# EasyEDA Pro project Board1.epro

# Schematic Schematic1
Board Name: Board1; Create Date: 2025-12-23; Page Name: P1; Project Name: test-dumbev2; Schematic Name: Schematic1; Update Date: 2026-01-03; Company: EasyEDA.com; Page Size: A4; Version: V1.0
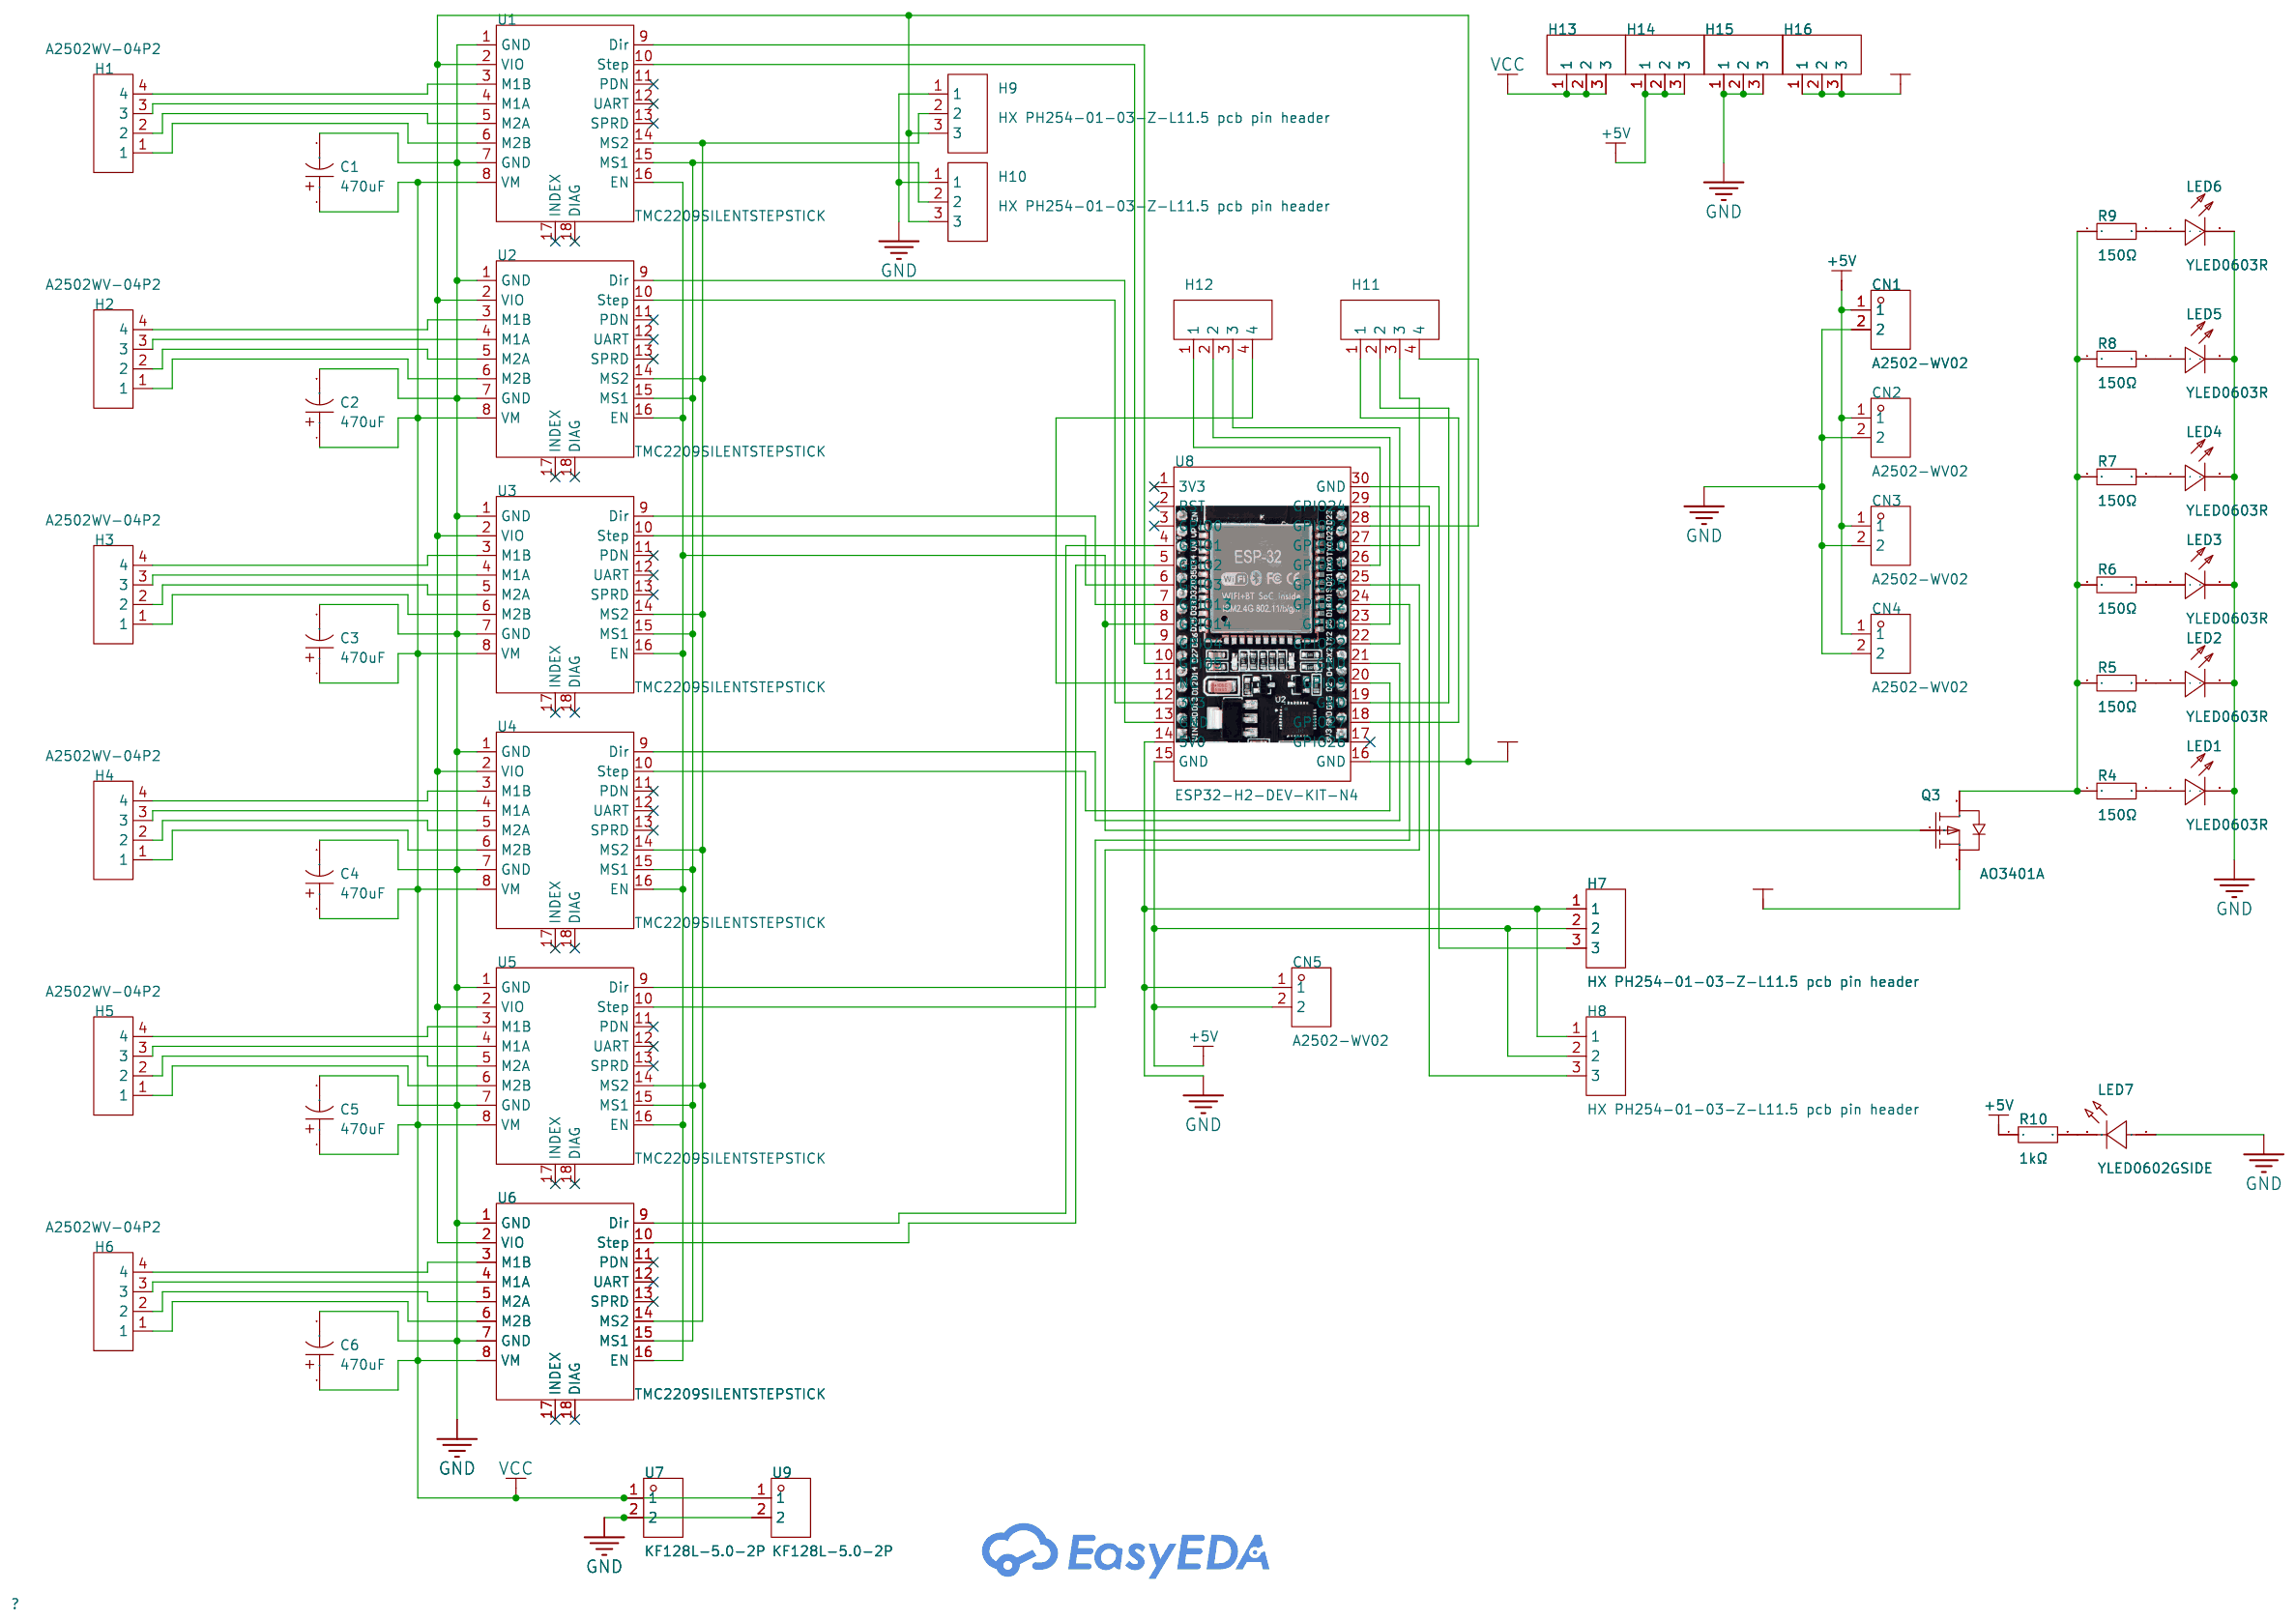
[diagram p0: schematic sheet]

## Parts
C1  470uF  [CAP-TH_BD10.0-P5.00-D0.6-FD]
C2  470uF  [CAP-TH_BD10.0-P5.00-D0.6-FD]
C3  470uF  [CAP-TH_BD10.0-P5.00-D0.6-FD]
C4  470uF  [CAP-TH_BD10.0-P5.00-D0.6-FD]
C5  470uF  [CAP-TH_BD10.0-P5.00-D0.6-FD]
C6  470uF  [CAP-TH_BD10.0-P5.00-D0.6-FD]
CN1  A2502-WV02  [CONN-TH_A2502-WV02]
CN2  A2502-WV02  [CONN-TH_A2502-WV02]
CN3  A2502-WV02  [CONN-TH_A2502-WV02]
CN4  A2502-WV02  [CONN-TH_A2502-WV02]
CN5  A2502-WV02  [CONN-TH_A2502-WV02]
H1  A2502WV-04P2  [CONN-TH_4P-P2.50_A2502WV-04P2]
H2  A2502WV-04P2  [CONN-TH_4P-P2.50_A2502WV-04P2]
H3  A2502WV-04P2  [CONN-TH_4P-P2.50_A2502WV-04P2]
H4  A2502WV-04P2  [CONN-TH_4P-P2.50_A2502WV-04P2]
H5  A2502WV-04P2  [CONN-TH_4P-P2.50_A2502WV-04P2]
H6  A2502WV-04P2  [CONN-TH_4P-P2.50_A2502WV-04P2]
H7  HX PH254-01-03-Z-L11.5 pcb pin header  [HDR-TH_3P-P2.54-V-M-1]
H8  HX PH254-01-03-Z-L11.5 pcb pin header  [HDR-TH_3P-P2.54-V-M-1]
H9  HX PH254-01-03-Z-L11.5 pcb pin header  [HDR-TH_3P-P2.54-V-M-1]
H10  HX PH254-01-03-Z-L11.5 pcb pin header  [HDR-TH_3P-P2.54-V-M-1]
H11  HX PH254-01-04-Z-L11.5 straight pin header  [HDR-TH_4P-HX-PH254-01-04-Z-L11.5]
H12  HX PH254-01-04-Z-L11.5 straight pin header  [HDR-TH_4P-HX-PH254-01-04-Z-L11.5]
H13  HX PH254-01-03-Z-L11.5 pcb pin header  [HDR-TH_3P-P2.54-V-M-1]
H14  HX PH254-01-03-Z-L11.5 pcb pin header  [HDR-TH_3P-P2.54-V-M-1]
H15  HX PH254-01-03-Z-L11.5 pcb pin header  [HDR-TH_3P-P2.54-V-M-1]
H16  HX PH254-01-03-Z-L11.5 pcb pin header  [HDR-TH_3P-P2.54-V-M-1]
LED1  YLED0603R  [LED0603-FD]
LED2  YLED0603R  [LED0603-FD]
LED3  YLED0603R  [LED0603-FD]
LED4  YLED0603R  [LED0603-FD]
LED5  YLED0603R  [LED0603-FD]
LED6  YLED0603R  [LED0603-FD]
LED7  YLED0602GSIDE  [LED-SMD_L1.6-W1.1-R-RD_GREEN]
Q3  AO3401A  [SOT-23-3_L2.9-W1.3-P1.90-LS2.4-BR]
R4  150Ω  [R0603]
R5  150Ω  [R0603]
R6  150Ω  [R0603]
R7  150Ω  [R0603]
R8  150Ω  [R0603]
R9  150Ω  [R0603]
R10  1kΩ  [R0603]
U1  TMC2209SILENTSTEPSTICK  [COMM-TH_TMC2209SILENTSTEPSTICK]
U2  TMC2209SILENTSTEPSTICK  [COMM-TH_TMC2209SILENTSTEPSTICK]
U3  TMC2209SILENTSTEPSTICK  [COMM-TH_TMC2209SILENTSTEPSTICK]
U4  TMC2209SILENTSTEPSTICK  [COMM-TH_TMC2209SILENTSTEPSTICK]
U5  TMC2209SILENTSTEPSTICK  [COMM-TH_TMC2209SILENTSTEPSTICK]
U6  TMC2209SILENTSTEPSTICK  [COMM-TH_TMC2209SILENTSTEPSTICK]
U7  KF128L-5.0-2P  [CONN-TH_P5.00_KF128L-5.0-2P]
U8  ESP32-H2-DEV-KIT-N4  [COMM-TH_L51.6-W25.4-P2.54-LS22.86]
U9  KF128L-5.0-2P  [CONN-TH_P5.00_KF128L-5.0-2P]

## Library data of the parts
C1-C6 = 50V470uF CD288: Capacitance:470uF Tolerance:±20% Tolerance:±20% Voltage Rating:50V Pin Spacing:5mm Diameter:10mm Height - Seated (Max):20mm Operating Temperature:-40℃~+105℃ Operating Temperature:-40℃~+105℃; LCSC Part Name: 470uF ±20% 50V; Supplier Part: C2960279; Manufacturer: HRK(鸿瑞凯电子); Supplier Footprint: 插件,D10xL20mm; JLCPCB Part Class: Extended Part; Supplier: LCSC; Tolerance: ±20%; Voltage Rating: 50V; Pin Spacing: 5mm; Diameter: 10mm; Height - Seated (Max): 20mm; Operating Temperature: -40℃~+105℃
CN1-CN5 = A2502-WV02: Supplier Part: C9900002556; Supplier Footprint: XHB2.542PIN端子母座; JLCPCB Part Class: Extended Part; Supplier: LCSC
H1-H6 = A2502WV-04P2: Pins Structure:1x4P Pitch:2.5mm Mounting Type:Through Hole Reference Series:- Number of Pins:4P Number of Rows:1 Number of PINs Per Row:4 Row Spacing:- Current Rating:3A Operating Temperature:-25℃~+85℃ Operating Temperature:-25℃~+85℃; LCSC Part Name: 白色 1x4P 间距:2.5mm 直插; Supplier Part: C476965; Manufacturer: HR(灿达); Supplier Footprint: 插件,P=2.5mm; JLCPCB Part Class: Extended Part; Datasheet: https://item.szlcsc.com/datasheet/A2502WV-04P2/483965.html; Supplier: LCSC; Pins Structure: 1x4P; Pitch: 2.5mm; Mounting Type: Through Hole; Number of Pins: 4P; Number of Rows: 1; Number of PINs Per Row: 4; Current Rating: 3A; Operating Temperature: -25℃~+85℃
H7-H10 H13-H16 = HX PH254-01-03-Z-L11.5 pcb pin header: Pin Structure:1x3P Pitch:2.54mm Circluar Pins/Square Pins:Pin Header Mounting Type:Through Hole Number of Rows:1 Number of Pins:3P Current Rating:3A Voltage Rating (Max):1kV Length of Mating Pin:6mm Insulation Height:2.5mm Length of End Connection Pin:3mm; LCSC Part Name: 1x3P 间距:2.54mm 方针 直插; Supplier Part: C52016391; Manufacturer: hanxia(韩下); Supplier Footprint: 插件,P=2.54mm; JLCPCB Part Class: Extended Part; Datasheet: https://item.szlcsc.com/datasheet/HX%2520PH254-01-03-Z-L11.5%2520pcb%2520pin%2520header/54760436.html; Supplier: LCSC; Pin Structure: 1x3P; Pitch: 2.54mm; Circluar Pins/Square Pins: Pin Header; Mounting Type: Through Hole; Number of Rows: 1; Number of Pins: 3P; Current Rating: 3A; Voltage Rating (Max): 1kV; Length of Mating Pin: 6mm; Insulation Height: 2.5mm; Length of End Connection Pin: 3mm; Contact Material: Brass; Contact Plating: Gold; Operating Temperature: -40℃~+105℃
H11 H12 = HX PH254-01-04-Z-L11.5 straight pin header: Pin Structure:1x4P Pitch:2.54mm Circluar Pins/Square Pins:Pin Header Mounting Type:Through Hole Number of Rows:1 Number of Pins:4P Current Rating:3A Voltage Rating (Max):1kV Length of Mating Pin:6mm Insulation Height:2.5mm Length of End Connection Pin:3mm; LCSC Part Name: 1x4P 间距:2.54mm 方针 直插; Supplier Part: C52016392; Manufacturer: hanxia(韩下); Supplier Footprint: 插件,P=2.54mm; JLCPCB Part Class: Extended Part; Datasheet: https://item.szlcsc.com/datasheet/HX%2520PH254-01-04-Z-L11.5%2520straight%2520pin%2520header/54760437.html; Supplier: LCSC; Pin Structure: 1x4P; Pitch: 2.54mm; Circluar Pins/Square Pins: Pin Header; Mounting Type: Through Hole; Number of Rows: 1; Number of Pins: 4P; Current Rating: 3A; Voltage Rating (Max): 1kV; Length of Mating Pin: 6mm; Insulation Height: 2.5mm; Length of End Connection Pin: 3mm; Contact Material: Brass; Contact Plating: Gold; Operating Temperature: -40℃~+105℃
LED1-LED6 = YLED0603R: Lamp Holder Type:-；- Illumination Color:Red Voltage - Forward(Vf):1.8V~2.4V Voltage - Forward(Vf):1.8V~2.4V Power(Watts):- Forward Current:25mA Wavelength - Dominant:620nm~625nm Wavelength - Dominant:620nm~625nm Peak Wavelength:- Diode Configuration:Discr; LCSC Part Name: 红色 独立二极管; Supplier Part: C19171390; Manufacturer: YONGYUTAI(永裕泰); Supplier Footprint: 0603; JLCPCB Part Class: Extended Part; Datasheet: https://item.szlcsc.com/datasheet/YLED0603R/20382441.html; Supplier: LCSC; Lamp Holder Type: -；-; Illumination Color: Red; Voltage - Forward(Vf): 1.8V~2.4V; Forward Current: 25mA; Wavelength - Dominant: 620nm~625nm; Diode Configuration: Discrete Diode; Luminous Intensity: 120mcd; Viewing Angle: 120°; Operating Temperature: -40℃~+85℃
LED7 = YLED0602GSIDE: Illumination Color:Emerald Green Voltage - Forward(Vf):2.5V~3.1V Voltage - Forward(Vf):2.5V~3.1V Power(Watts):100mW Forward Current:20mA Wavelength - Dominant:534nm Wavelength - Dominant:534nm Peak Wavelength:525nm Diode Configuration:- Lens Color:Water C; Supplier Part: C41419561; Manufacturer: YONGYUTAI(永裕泰); Supplier Footprint: 0603; JLCPCB Part Class: Extended Part; Datasheet: https://item.szlcsc.com/datasheet/YLED0602GSIDE/43252029.html; Supplier: LCSC; Illumination Color: Emerald Green; Voltage - Forward(Vf): 2.5V~3.1V; Power(Watts): 100mW; Forward Current: 20mA; Wavelength - Dominant: 534nm; Peak Wavelength: 525nm; Lens Color: Water Clear; Luminous Intensity: 430mcd; Viewing Angle: 120°; Operating Temperature: -40℃~+85℃
Q3 = AO3401A_C5380686: Number:1 P-Channel Drain to Source Voltage:30V Current - Continuous Drain(Id):4.2A RDS(on):90mΩ@2.5V,1A Pd - Power Dissipation:350mW Gate Threshold Voltage (Vgs(th)):1.4V Gate Charge(Qg):7.2nC Input Capacitance(Ciss):880pF Reverse Transfer Capacitance (Cr; LCSC Part Name: P沟道,电流:-4.2A,耐压:-30V; Supplier Part: C5380686; Manufacturer: FUXINSEMI(富芯森美); Supplier Footprint: SOT-23; JLCPCB Part Class: Extended Part; Datasheet: https://item.szlcsc.com/datasheet/AO3401A/6248450.html; Supplier: LCSC; Number: 1 P-Channel; Drain to Source Voltage: 30V; Current - Continuous Drain(Id): 4.2A; RDS(on): 90mΩ@2.5V,1A; Pd - Power Dissipation: 350mW; Gate Threshold Voltage (Vgs(th)): 1.4V; Gate Charge(Qg): 7.2nC; Input Capacitance(Ciss): 880pF; Reverse Transfer Capacitance (Crss@Vds): 65pF; Operating Temperature: -55℃~+150℃
R4-R9 = RMC06031505%N: Type:Thick Film Resistor Resistance:150Ω Tolerance:±5% Tolerance:±5% Power(Watts):100mW Voltage-Supply(Max):50V Temperature Coefficient:±100ppm/℃ Temperature Coefficient:±100ppm/℃ Operating Temperature:-55℃~+155℃ Operating Temperature:-55℃~+155℃; LCSC Part Name: 150Ω ±5% 100mW; Supplier Part: C325755; Manufacturer: Tyohm(幸亚电阻); Supplier Footprint: 0603; JLCPCB Part Class: Extended Part; Datasheet: https://item.szlcsc.com/datasheet/RMC06031505%2525N/305960.html; Supplier: LCSC; Type: Thick Film Resistor; Tolerance: ±5%; Power(Watts): 100mW; Voltage-Supply(Max): 50V; Temperature Coefficient: ±100ppm/℃; Operating Temperature: -55℃~+155℃
R10 = 0603WAF1001T5E: Type:Thick Film Resistor Resistance:1kΩ Tolerance:±1% Tolerance:±1% Power(Watts):100mW Voltage-Supply(Max):75V Temperature Coefficient:±100ppm/℃ Temperature Coefficient:±100ppm/℃ Operating Temperature:-55℃~+155℃ Operating Temperature:-55℃~+155℃; LCSC Part Name: 1kΩ ±1% 100mW 厚膜电阻; Supplier Part: C21190; Manufacturer: UNI-ROYAL(厚声); Supplier Footprint: 0603; JLCPCB Part Class: Basic Part; Datasheet: https://item.szlcsc.com/datasheet/0603WAF1001T5E/21904.html; Supplier: LCSC; Type: Thick Film Resistor; Tolerance: ±1%; Power(Watts): 100mW; Voltage-Supply(Max): 75V; Temperature Coefficient: ±100ppm/℃; Operating Temperature: -55℃~+155℃
U1-U6 = TMC2209SILENTSTEPSTICK: Type:Power Management; Supplier Part: C17375345; Manufacturer: TRINAMIC; JLCPCB Part Class: Extended Part; Datasheet: https://item.szlcsc.com/datasheet/TMC2209SILENTSTEPSTICK/18504516.html; Supplier: LCSC; Type: Power Management
U7 U9 = KF128L-5.0-2P: LCSC Part Name: 间距P=5.0mm 2Pin位 直插 直针 可拼接 铜 环保; Supplier Part: C474938; Manufacturer: KEFA(科发); Supplier Footprint: 插件,P=5mm; JLCPCB Part Class: Extended Part; Datasheet: https://item.szlcsc.com/datasheet/KF128L-5.0-2P/481556.html; Supplier: LCSC
U8 = ESP32-H2-DEV-KIT-N4: Supplier Part: C9900173960; Supplier Footprint: 插件; Supplier: LCSC

## Nets
+3V3: H9.3 H10.3 H16.1 H16.2 H16.3 Q3.2(S) U1.2(VIO) U2.2(VIO) U3.2(VIO) U4.2(VIO) U5.2(VIO) U6.2(VIO) U8.16(GND)
+5V: CN1.1 CN2.1 CN3.1 CN4.1 CN5.2 H7.2 H8.2 H14.1 H14.2 H14.3 R10.1 U8.15(GND)
GND: C1.2 C2.2 C3.2 C4.2 C5.2 C6.2 CN1.2 CN2.2 CN3.2 CN4.2 CN5.1 H7.1 H8.1 H9.1 H10.1 H15.1 H15.2 H15.3 LED1.2(-) LED2.2(-) LED3.2(-) LED4.2(-) LED5.2(-) LED6.2(-) LED7.1(A) U1.1(GND) U1.7(GND) U2.1(GND) U2.7(GND) U3.1(GND) U3.7(GND) U4.1(GND) U4.7(GND) U5.1(GND) U5.7(GND) U6.1(GND) U6.7(GND) U7.2 U8.14(5V0) U9.2
VCC: C1.1 C2.1 C3.1 C4.1 C5.1 C6.1 H13.1 H13.2 H13.3 U1.8(VM) U2.8(VM) U3.8(VM) U4.8(VM) U5.8(VM) U6.8(VM) U7.1 U9.1
$1N6110: H2.1 U2.6(M2B)
$1N6116: H2.2 U2.5(M2A)
$1N6130: H2.3 U2.4(M1A)
$1N6134: H2.4 U2.3(M1B)
$1N6138: H1.4 U1.3(M1B)
$1N6142: H1.3 U1.4(M1A)
$1N6144: H1.2 U1.5(M2A)
$1N6148: H1.1 U1.6(M2B)
$1N6152: H3.4 U3.3(M1B)
$1N6156: H3.3 U3.4(M1A)
$1N6158: H3.2 U3.5(M2A)
$1N6162: H3.1 U3.6(M2B)
$1N6166: H4.4 U4.3(M1B)
$1N6170: H4.3 U4.4(M1A)
$1N6172: H4.2 U4.5(M2A)
$1N6176: H4.1 U4.6(M2B)
$1N6180: H5.4 U5.3(M1B)
$1N6184: H5.3 U5.4(M1A)
$1N6186: H5.2 U5.5(M2A)
$1N6190: H5.1 U5.6(M2B)
$1N6194: H6.4 U6.3(M1B)
$1N6198: H6.3 U6.4(M1A)
$1N6200: H6.2 U6.5(M2A)
$1N6204: H6.1 U6.6(M2B)
$1N6621: U1.10(Step) U8.9(GPIO4)
$1N6634: U2.10(Step) U8.12(3V3)
$1N6640: U2.9(Dir) U8.13(GND)
$1N6650: U3.10(Step) U8.6(GPIO3)
$1N6666: U3.9(Dir) U8.7(GPIO13)
$1N6678: U4.10(Step) U8.20(GPIO9)
$1N6689: U4.9(Dir) U8.21(GND)
$1N6700: U5.10(Step) U8.24(GPIO12)
$1N6708: U5.9(Dir) U8.25(GPIO25)
$1N8390: H7.3 U8.30(GND)
$1N8397: H8.3 U8.29(GPIO24)
$1N8979: H10.2 U1.15(MS1) U2.15(MS1) U3.15(MS1) U4.15(MS1) U5.15(MS1) U6.15(MS1)
$1N9329: H9.2 U1.14(MS2) U2.14(MS2) U3.14(MS2) U4.14(MS2) U5.14(MS2) U6.14(MS2)
$1N9443: U1.9(Dir) U8.10(GPIO5)
$1N9499: U6.10(Step) U8.5(GPIO2)
$1N9508: U6.9(Dir) U8.4(GPIO1)
$1N13058: H12.1 U8.26(GPIO11)
$1N13065: H12.2 U8.23(GPIO8)
$1N13086: H12.3 U8.22(GPIO22)
$1N13111: H11.2 U8.19(GND)
$1N13121: H11.1 U8.18(GPIO27)
$1N14592: LED1.1(+) R4.2
$1N15391: LED2.1(+) R5.2
$1N15491: LED3.1(+) R6.2
$1N15591: LED4.1(+) R7.2
$1N17393: LED5.1(+) R8.2
$1N17491: LED6.1(+) R9.2
$1N19393: LED7.2(K) R10.2
$1N19496: Q3.3(D) R4.1 R5.1 R6.1 R7.1 R8.1 R9.1
$1N19657: Q3.1(G) U1.16(EN) U2.16(EN) U3.16(EN) U4.16(EN) U5.16(EN) U6.16(EN) U8.8(GPIO14)
$1N20868: H11.3 U8.27(GPIO10)
$1N21347: H11.4 U8.28(GPIO23)
$1N21361: H12.4 U8.11(NC)

Not connected (* = marked no-connect by the designer): U1 11(PDN)* 12(UART)* 13(SPRD)* 17(INDEX)* 18(DIAG)*; U2 11(PDN)* 12(UART)* 13(SPRD)* 17(INDEX)* 18(DIAG)*; U3 11(PDN)* 12(UART)* 13(SPRD)* 17(INDEX)* 18(DIAG)*; U4 11(PDN)* 12(UART)* 13(SPRD)* 17(INDEX)* 18(DIAG)*; U5 11(PDN)* 12(UART)* 13(SPRD)* 17(INDEX)* 18(DIAG)*; U6 11(PDN)* 12(UART)* 13(SPRD)* 17(INDEX)* 18(DIAG)*; U8 1(3V3)* 2(RST)* 3(GPIO0)* 17(GPIO26)*

# Board PCB1
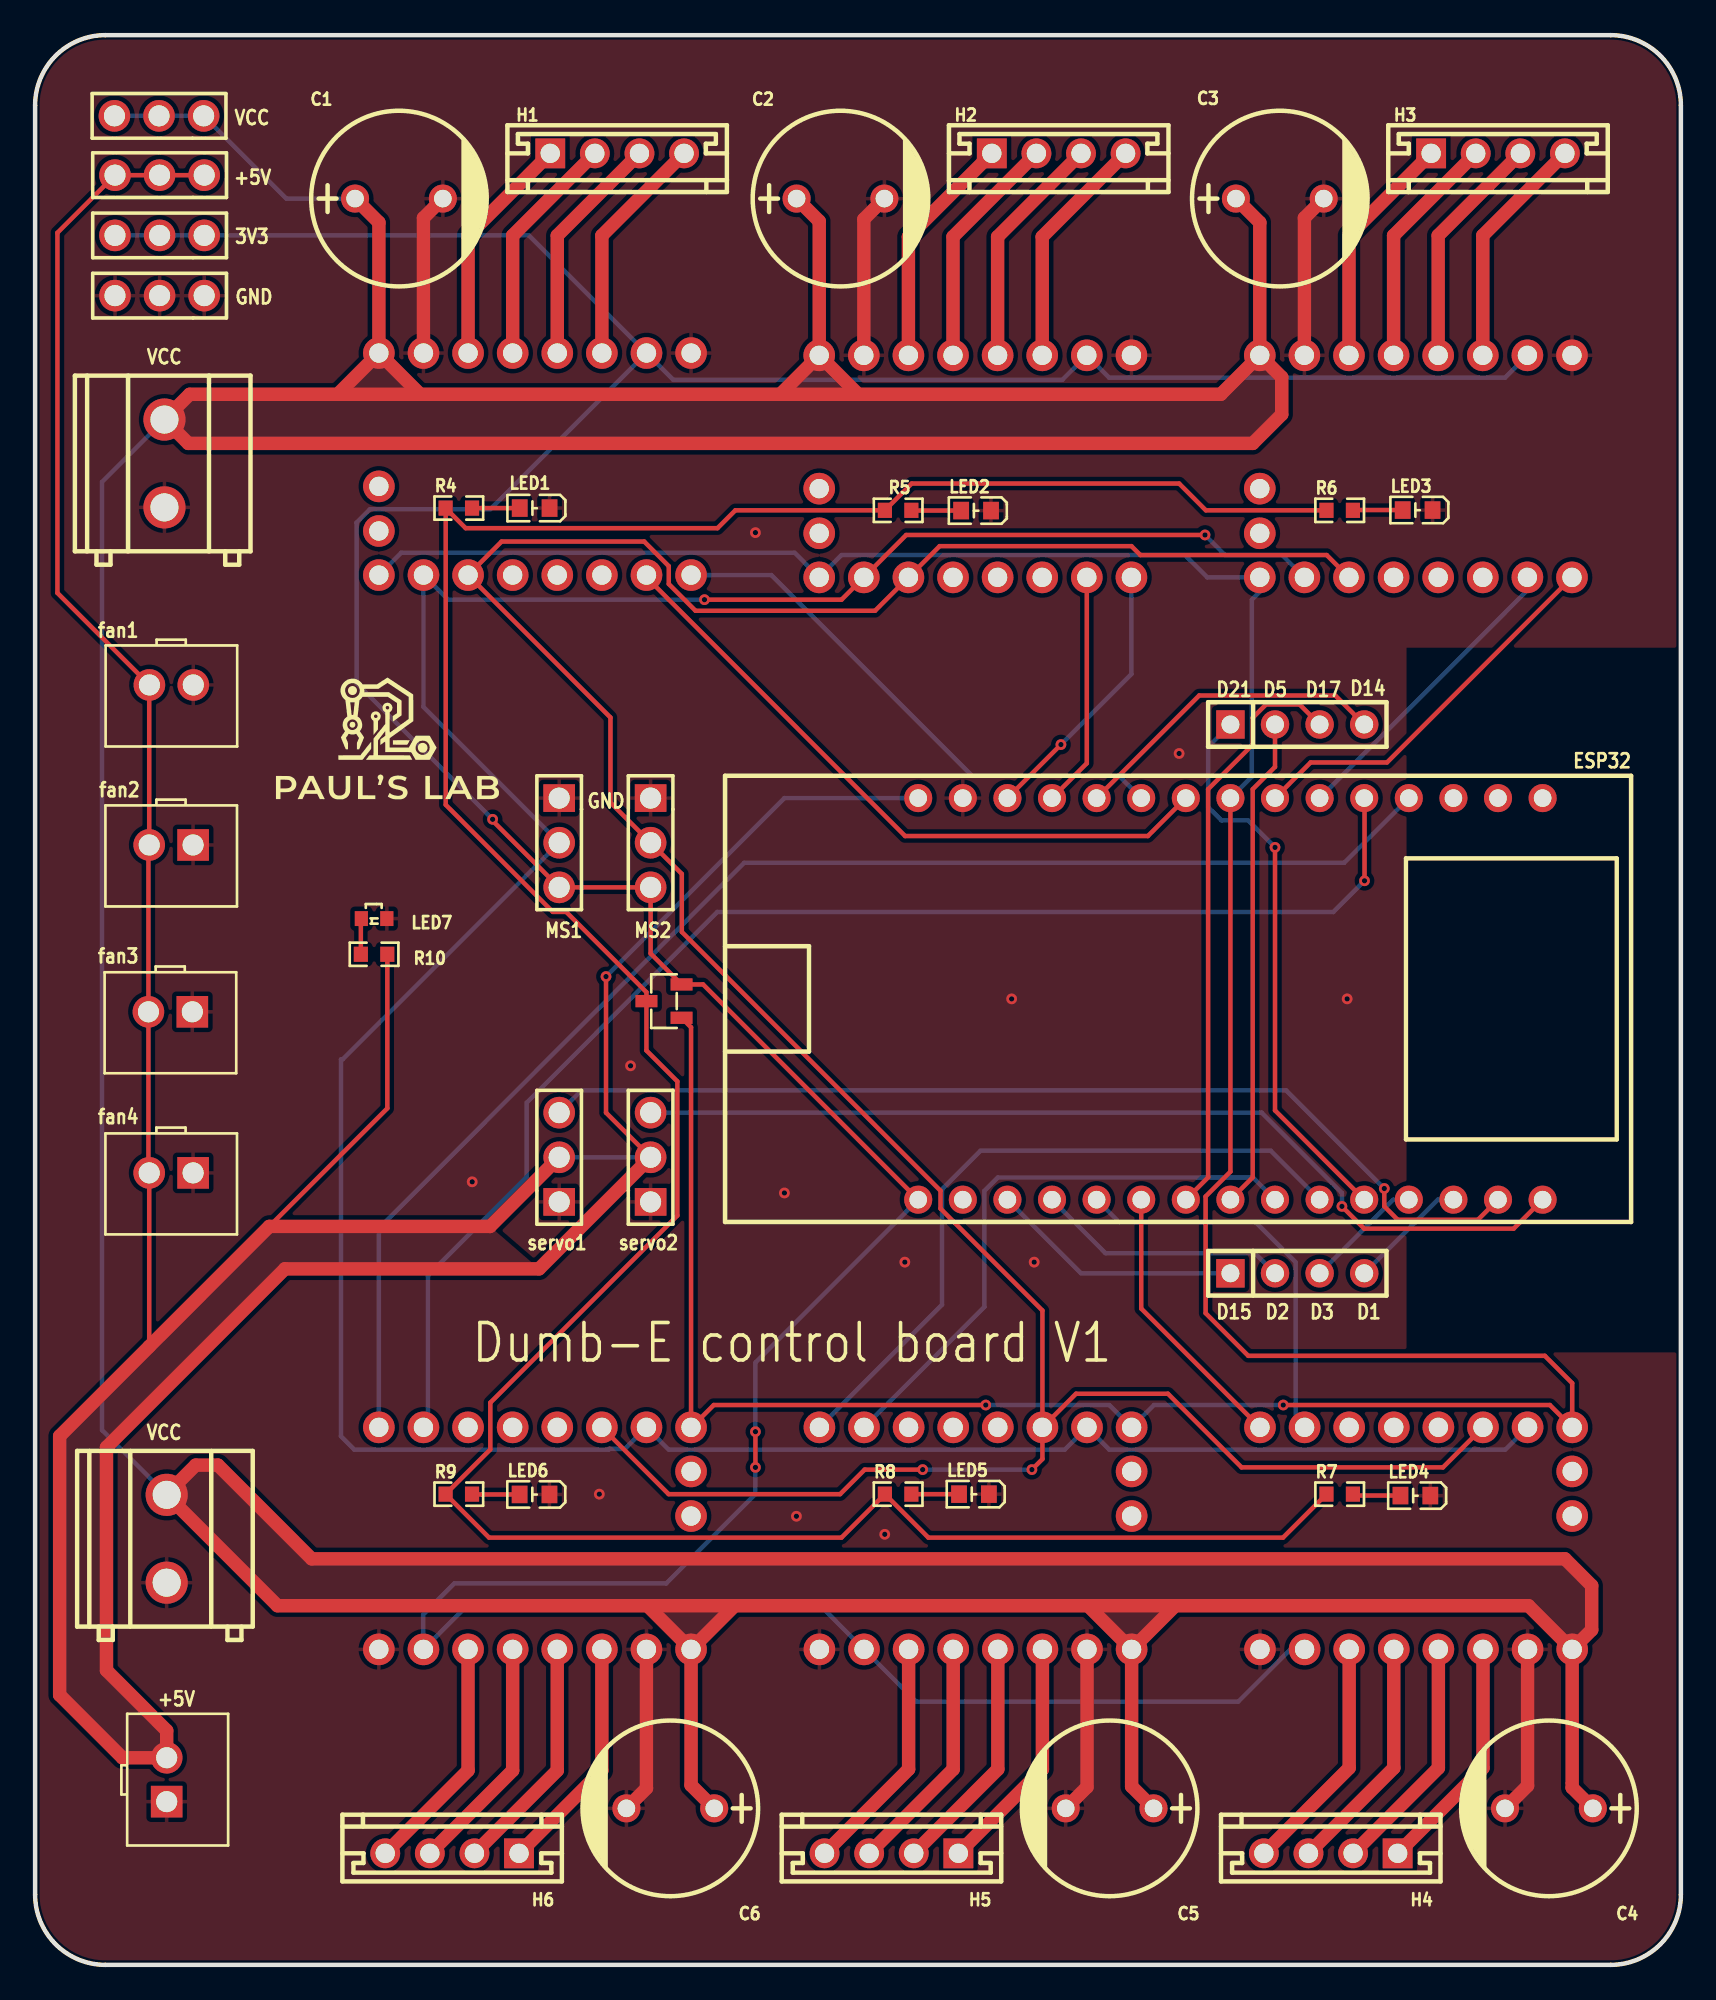
[diagram p1: board, top side]
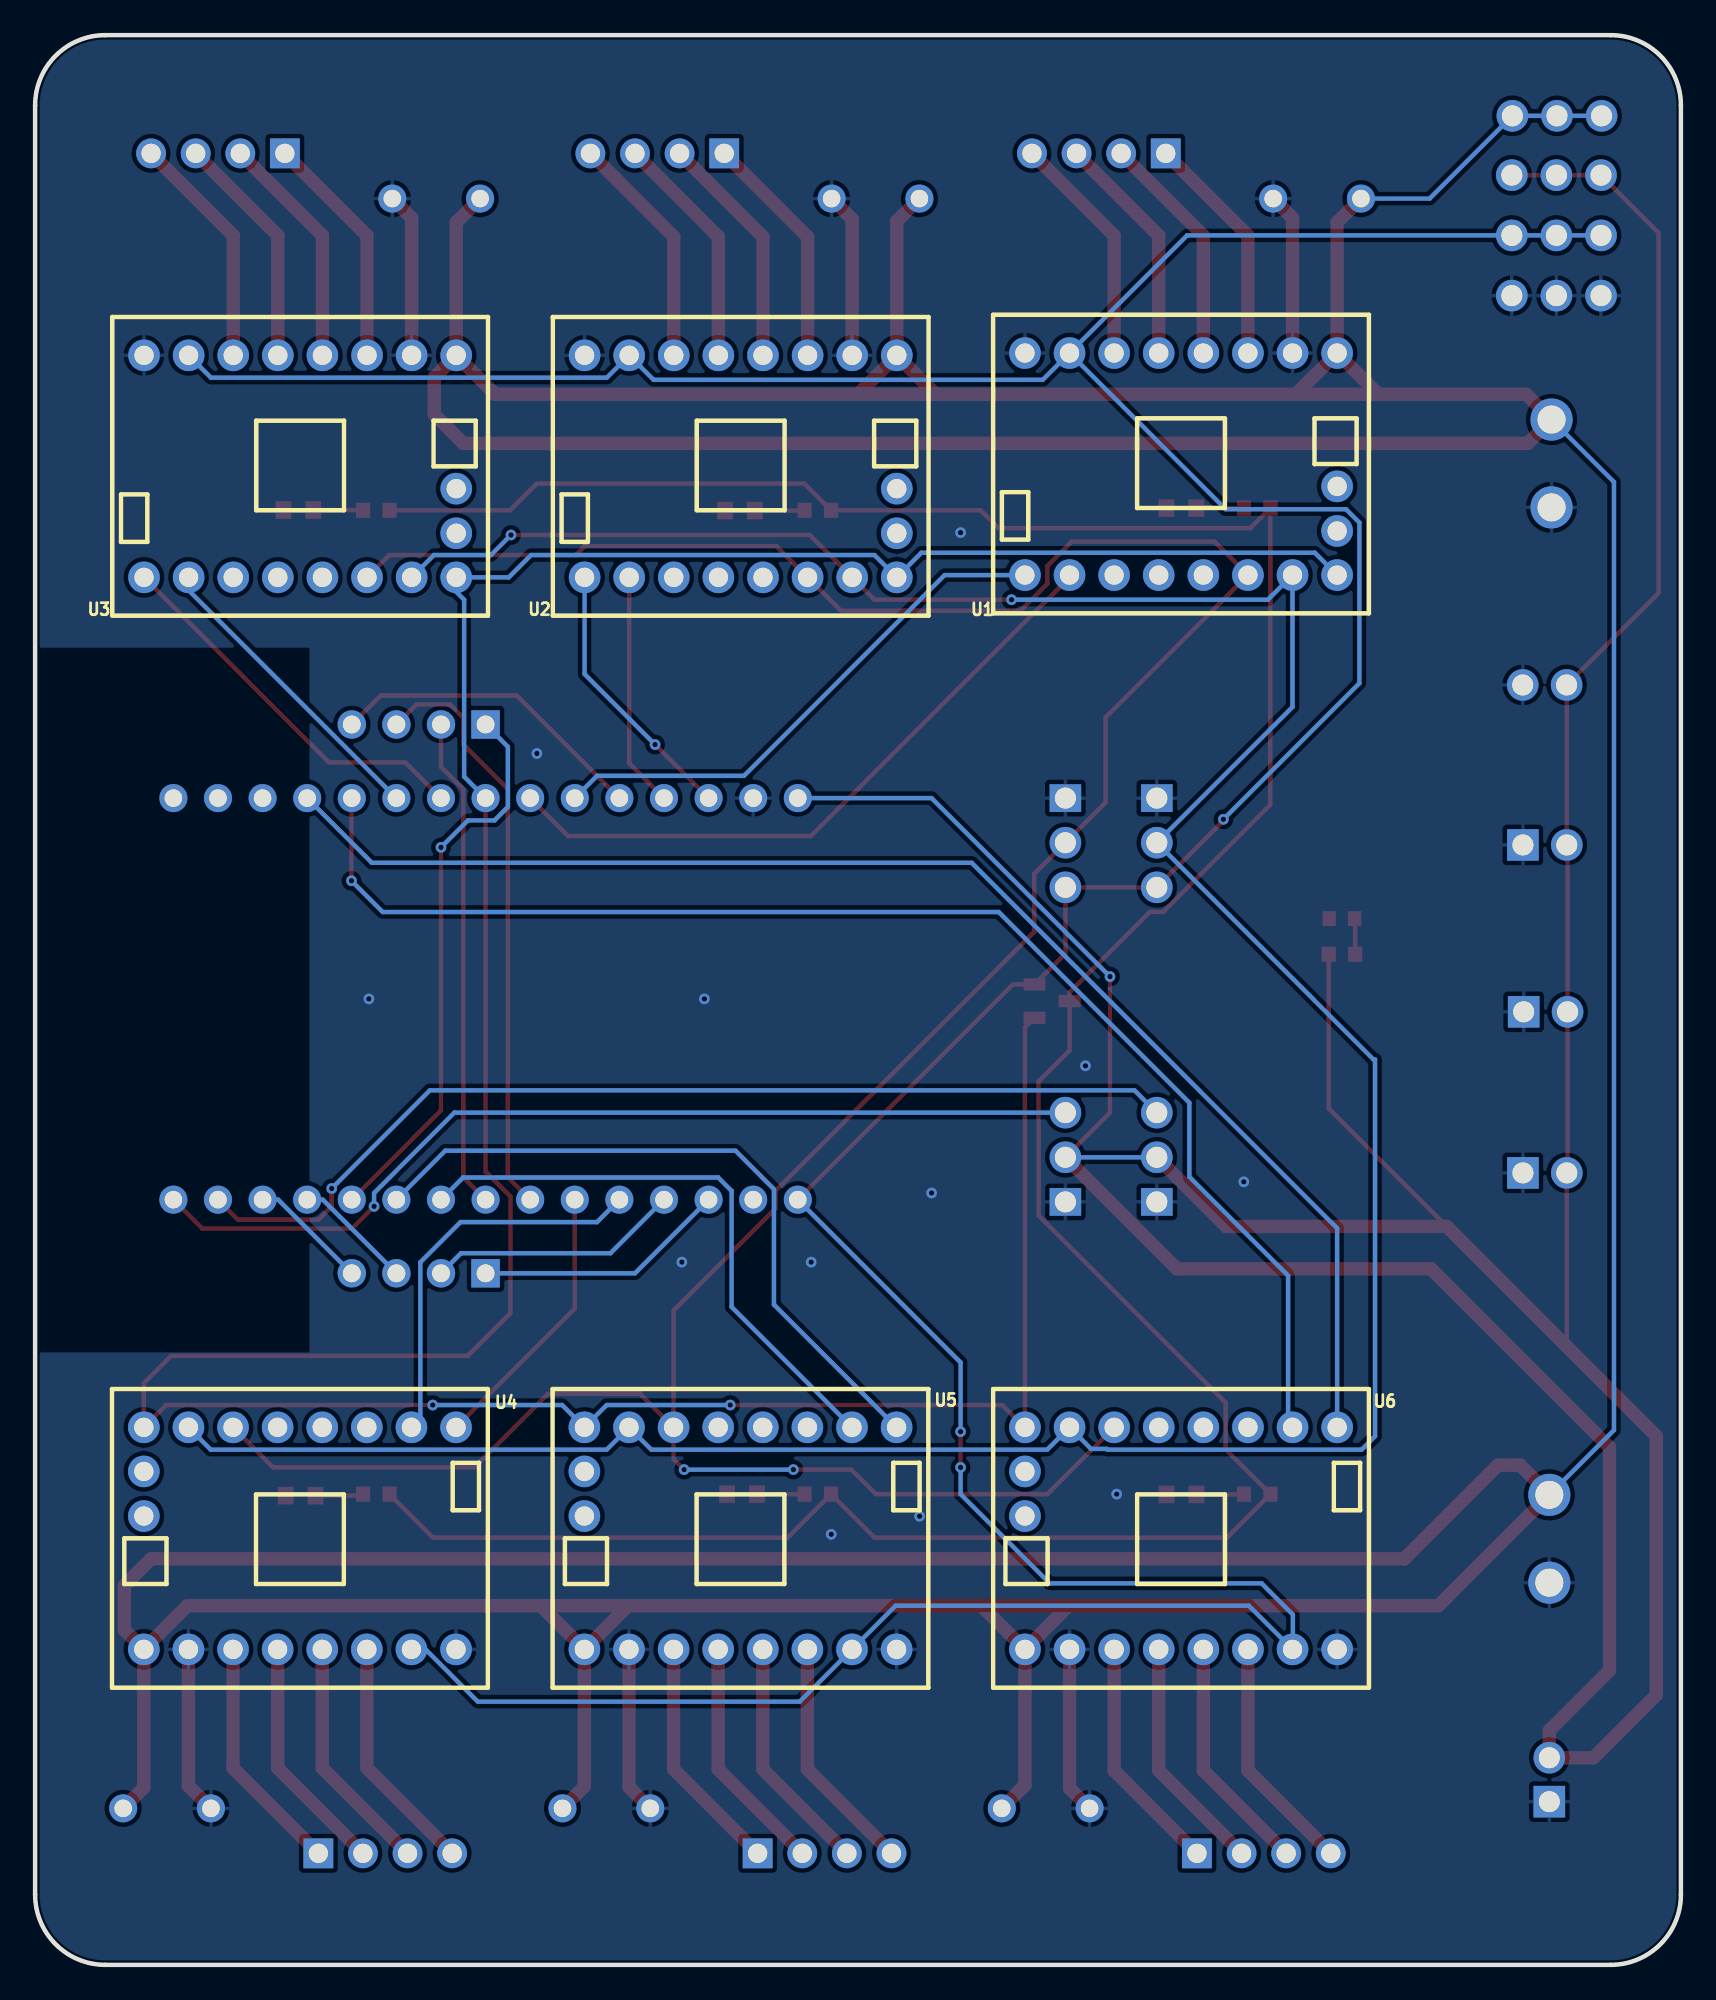
[diagram p2: board, bottom side, seen from below]

Outline 93.73 x 109.85 mm; copper layers: Top Layer, Bottom Layer. Coordinates in mm from the lower left corner of the outline.
Outline path: 0,105.85 0,4 arc(1.17,1.17) 4,0 89.73,0 arc(92.55,1.17) 93.73,4 93.73,105.85 arc(92.55,108.68) 89.73,109.85 4,109.85 arc(1.17,108.68) 0,105.85
Stack: Top Layer 0.035mm / Dielectric1 1.51mm FR4 er 4.5 / Bottom Layer 0.035mm

## Design rules (mm)
template: Custom Config
spacing copperThickness1oz (default): track to track 0.2, other pairs 0.152 to 0.5
spacing copperThickness2oz: track to track 0.203, other pairs 0.152 to 0.3
track width copperThickness1oz (default): min 0.127, default 0.254, max 2.54
track width copperThickness2oz: min 0.203, default 0.254, max 2.54
differential pair differentialPair (default): width min 0.127, default 0.254, max 2.54; gap min 0.152, default 0.152
via viaSize (default): diameter min 0.5, default 0.61, max 10; hole min 0.3, default 0.305, max 6.3

## Placement (name value [footprint] x y rotation side)
C1  470uF  [CAP-TH_BD10.0-P5.00-D0.6-FD]  20.72 100.55 0 top
C2  470uF  [CAP-TH_BD10.0-P5.00-D0.6-FD]  45.87 100.55 0 top
C3  470uF  [CAP-TH_BD10.0-P5.00-D0.6-FD]  70.88 100.55 0 top
C4  470uF  [CAP-TH_BD10.0-P5.00-D0.6-FD]  86.21 8.91 180 top
C5  470uF  [CAP-TH_BD10.0-P5.00-D0.6-FD]  61.19 8.91 180 top
C6  470uF  [CAP-TH_BD10.0-P5.00-D0.6-FD]  36.17 8.91 180 top
CN1  A2502-WV02  [CONN-TH_A2502-WV02]  7.75 63.75 0 top
CN2  A2502-WV02  [CONN-TH_A2502-WV02]  7.7 54.26 0 top
CN3  A2502-WV02  [CONN-TH_A2502-WV02]  7.75 45.08 0 top
CN4  A2502-WV02  [CONN-TH_A2502-WV02]  7.76 72.86 0 top
CN5  A2502-WV02  [CONN-TH_A2502-WV02]  7.49 10.54 90 top
H1  A2502WV-04P2  [CONN-TH_4P-P2.50_A2502WV-04P2]  33.15 103.12 0 top
H2  A2502WV-04P2  [CONN-TH_4P-P2.50_A2502WV-04P2]  58.29 103.12 0 top
H3  A2502WV-04P2  [CONN-TH_4P-P2.50_A2502WV-04P2]  83.31 103.12 0 top
H4  A2502WV-04P2  [CONN-TH_4P-P2.50_A2502WV-04P2]  73.79 6.35 180 top
H5  A2502WV-04P2  [CONN-TH_4P-P2.50_A2502WV-04P2]  48.77 6.35 180 top
H6  A2502WV-04P2  [CONN-TH_4P-P2.50_A2502WV-04P2]  23.75 6.35 180 top
H7  HX PH254-01-03-Z-L11.5 pcb pin header  [HDR-TH_3P-P2.54-V-M-1]  35.05 45.97 90 top
H8  HX PH254-01-03-Z-L11.5 pcb pin header  [HDR-TH_3P-P2.54-V-M-1]  29.84 45.97 90 top
H9  HX PH254-01-03-Z-L11.5 pcb pin header  [HDR-TH_3P-P2.54-V-M-1]  35.05 63.88 270 top
H10  HX PH254-01-03-Z-L11.5 pcb pin header  [HDR-TH_3P-P2.54-V-M-1]  29.84 63.88 270 top
H11  HX PH254-01-04-Z-L11.5 straight pin header  [HDR-TH_4P-HX-PH254-01-04-Z-L11.5]  71.88 39.37 0 top
H12  HX PH254-01-04-Z-L11.5 straight pin header  [HDR-TH_4P-HX-PH254-01-04-Z-L11.5]  71.88 70.61 0 top
H13  HX PH254-01-03-Z-L11.5 pcb pin header  [HDR-TH_3P-P2.54-V-M-1]  7.06 105.26 180 top
H14  HX PH254-01-03-Z-L11.5 pcb pin header  [HDR-TH_3P-P2.54-V-M-1]  7.09 101.88 180 top
H15  HX PH254-01-03-Z-L11.5 pcb pin header  [HDR-TH_3P-P2.54-V-M-1]  7.09 95.03 180 top
H16  HX PH254-01-03-Z-L11.5 pcb pin header  [HDR-TH_3P-P2.54-V-M-1]  7.09 98.45 180 top
LED1  YLED0603R  [LED0603-FD]  28.45 82.93 0 top
LED2  YLED0603R  [LED0603-FD]  53.59 82.79 0 top
LED3  YLED0603R  [LED0603-FD]  78.73 82.82 0 top
LED4  YLED0603R  [LED0603-FD]  78.61 26.71 0 top
LED5  YLED0603R  [LED0603-FD]  53.47 26.8 0 top
LED6  YLED0603R  [LED0603-FD]  28.44 26.78 0 top
LED7  YLED0602GSIDE  [LED-SMD_L1.6-W1.1-R-RD_GREEN]  19.3 59.56 0 top
Q3  AO3401A  [SOT-23-3_L2.9-W1.3-P1.90-LS2.4-BR]  35.81 54.86 0 top
R4  150Ω  [R0603]  24.13 82.93 0 top
R5  150Ω  [R0603]  49.15 82.8 0 top
R6  150Ω  [R0603]  74.29 82.8 0 top
R7  150Ω  [R0603]  74.29 26.8 0 top
R8  150Ω  [R0603]  49.15 26.8 0 top
R9  150Ω  [R0603]  24.13 26.8 0 top
R10  1kΩ  [R0603]  19.3 57.53 180 top
U1  TMC2209SILENTSTEPSTICK  [COMM-TH_TMC2209SILENTSTEPSTICK]  28.47 85.44 90 bottom
U2  TMC2209SILENTSTEPSTICK  [COMM-TH_TMC2209SILENTSTEPSTICK]  53.54 85.31 90 bottom
U3  TMC2209SILENTSTEPSTICK  [COMM-TH_TMC2209SILENTSTEPSTICK]  78.63 85.31 90 bottom
U4  TMC2209SILENTSTEPSTICK  [COMM-TH_TMC2209SILENTSTEPSTICK]  78.65 24.28 270 bottom
U5  TMC2209SILENTSTEPSTICK  [COMM-TH_TMC2209SILENTSTEPSTICK]  53.56 24.28 270 bottom
U6  TMC2209SILENTSTEPSTICK  [COMM-TH_TMC2209SILENTSTEPSTICK]  28.47 24.28 270 bottom
U7  KF128L-5.0-2P  [CONN-TH_P5.00_KF128L-5.0-2P]  7.49 24.26 270 top
U8  ESP32-H2-DEV-KIT-N4  [COMM-TH_L51.6-W25.4-P2.54-LS22.86]  68.07 54.99 270 top
U9  KF128L-5.0-2P  [CONN-TH_P5.00_KF128L-5.0-2P]  7.37 85.47 270 top

## Footprints (pads in the part's own frame, mm; a bottom-side part is the same pattern mirrored in y, then rotated)
CAP-TH_BD10.0-P5.00-D0.6-FD
  round 1.6 hole 1: 1(-2.5,0) 2(2.5,0)
COMM-TH_L51.6-W25.4-P2.54-LS22.86
  round 1.6 hole 1: 1(-11.43,17.78) 2(-11.43,15.24) 3(-11.43,12.7) 4(-11.43,10.16) 5(-11.43,7.62) 6(-11.43,5.08) 7(-11.43,2.54) 8(-11.43,0) 9(-11.43,-2.54) 10(-11.43,-5.08) 11(-11.43,-7.62) 12(-11.43,-10.16) 13(-11.43,-12.7) 14(-11.43,-15.24) 15(-11.43,-17.78) 16(11.43,-17.78) 17(11.43,-15.24) 18(11.43,-12.7) 19(11.43,-10.16) 20(11.43,-7.62) 21(11.43,-5.08) 22(11.43,-2.54) 23(11.43,0) 24(11.43,2.54) 25(11.43,5.08) 26(11.43,7.62) 27(11.43,10.16) 28(11.43,12.7) 29(11.43,15.24) 30(11.43,17.78)
COMM-TH_TMC2209SILENTSTEPSTICK
  round 1.8 hole 1.1: 1(6.32,8.89) 2(6.32,6.35) 3(6.32,3.81) 4(6.32,1.27) 5(6.32,-1.27) 6(6.32,-3.81) 7(6.32,-6.35) 8(6.32,-8.89) 9(-6.32,8.89) 10(-6.32,6.35) 11(-6.32,3.81) 12(-6.32,1.27) 13(-6.32,-1.27) 14(-6.32,-3.81) 15(-6.32,-6.35) 16(-6.32,-8.89) 17(-3.81,-8.89) 18(-1.27,-8.89)
CONN-TH_4P-P2.50_A2502WV-04P2
  rect 1.7x1.7 hole 1.1: 1(-3.81,0)
  round 1.7 hole 1.1: 2(-1.27,0) 3(1.27,0) 4(3.81,0)
CONN-TH_A2502-WV02
  rect 1.8x1.8 hole 1.2: 1(-1.25,0)
  round 1.8 hole 1.2: 2(1.25,0)
CONN-TH_P5.00_KF128L-5.0-2P
  round 2.4 hole 1.6: 1(-2.5,0) 2(2.5,0)
HDR-TH_3P-P2.54-V-M-1
  round 1.801 hole 1.2: 1(-2.54,0)
  round 1.8 hole 1.2: 2(0,0) 3(2.54,0)
HDR-TH_4P-HX-PH254-01-04-Z-L11.5
  rect 1.62x1.62 hole 1.02: 1(-3.81,0)
  round 1.62 hole 1.02: 2(-1.27,0) 3(1.27,0) 4(3.81,0)
LED0603-FD
  rect 0.9x1 smd: 1(-0.85,0) 2(0.85,0)
LED-SMD_L1.6-W1.1-R-RD_GREEN
  rect 0.75x0.85 smd: 1(0.725,0) 2(-0.725,0)
R0603
  rect 0.806x0.864 smd: 1(-0.753,0) 2(0.753,0)
SOT-23-3_L2.9-W1.3-P1.90-LS2.4-BR
  rect 1.25x0.7 smd: 1(1,-0.95) 2(1,0.95) 3(-1,0)

## Nets
As in the schematic.

Pads without a net: U1 11 12 13 17 18; U2 11 12 13 17 18; U3 11 12 13 17 18; U4 11 12 13 17 18; U5 11 12 13 17 18; U6 11 12 13 17 18; U8 1 2 3 17

## Via types
v1: diameter 0.61, hole 0.305, Top Layer to Bottom Layer, 27 vias

## Routing (per net, layer and track width the routed paths; a pad name or vN(x,y) marks a point on that pad's centre or on a via; arc(x,y) is an arc through that point)
+3V3: length 260.6
  Top Layer w0.254: v1(41.02,30.35) v1(41.02,28.32) ; U8.16 38.04,55.81 Q3.2 35.05,57.58 35.05,61.34 29.84,61.34 26.05,65.13 v1(26.05,65.21)
  Bottom Layer w0.254: v1(41.02,28.32) 41.02,26.8 35.94,21.72 23.88,21.72 22.1,19.94 22.1,17.98 U6.2 24.6,20.45 44.72,20.45 U5.2 50.18,14.99 68.52,14.99 71.49,17.96 U4.2 ; U1.2 25.93,82.87 19.07,82.87 18.31,82.1 18.31,72.96 v1(26.05,65.21) ; U1.2 36.34,90.23 58.5,90.23 U2.2 61.16,90.36 83.71,90.36 U3.2 ; U1.2 28.12,98.45 H16.1 H16.2 H16.3 ; U8.16 41.02,34.29 v1(41.02,30.35)
+5V: length 246.4
  Top Layer w0.254: R10.1 20.06,48.76 13.33,42.04 ; H7.2 32.51,48.51 v1(32.51,56.26) ; H14.1 H14.2 H14.3 1.27,98.6 1.27,78.1 CN4.1 6.5,72.85 CN1.1 6.45,63.71 CN2.1 6.45,45.13 CN3.1 6.5,35.2
  Top Layer w0.762: H7.2 28.7,39.62 14.22,39.62 4.06,29.46 4.06,16.76 7.49,13.33 CN5.2 4.97,11.79 1.4,15.37 1.4,30.1 13.33,42.04 25.91,42.04 H8.2
  Bottom Layer w0.254: v1(32.51,56.26) 42.67,66.42 U8.15 ; H7.2 H8.2
GND: length 56.7
  Top Layer w0.762: U5.7 59.91,10.12 C5.2 ; U6.7 34.82,10.05 C6.2 ; U3.7 72.28,99.45 C3.2 ; U4.7 85,10.19 C4.2 ; C2.2 47.19,99.38 U2.7 ; C1.2 22.12,99.45 U1.7
  vias: v1(24.89,44.58) v1(32.13,26.8) v1(33.91,51.18) v1(41.02,81.53) v1(42.67,43.94) v1(43.36,25.54) v1(48.39,24.51) v1(49.53,40) v1(55.61,54.99) v1(56.9,40) v1(65.15,68.96) v1(74.72,54.99)
VCC: length 471.5
  Top Layer w0.254: U5.8 62.19,17.71 62.01,17.71 62.27,17.45 62.45,17.45 ; 37.36,17.47 37.12,17.71 U6.8 ; 62.19,10.41 62.45,10.16 ; 87.28,10.34 87.54,10.09
  Top Layer w0.762: U1.8 17.23,89.41 ; U1.8 21.93,89.41 ; U1.8 19.58,99.19 C1.1 ; 17.23,89.41 21.93,89.41 ; 17.23,89.41 8.8,89.41 U9.1 8.72,86.61 69.34,86.61 70.99,88.26 70.99,90.38 U3.8 ; U5.8 64.93,20.45 ; U5.8 59.96,20.45 ; U5.8 62.45,10.16 C5.1 ; 64.93,20.45 85.05,20.45 U4.8 ; 64.93,20.45 59.96,20.45 ; 46.87,89.41 67.53,89.41 U3.8 ; 46.87,89.41 42.44,89.41 ; 46.87,89.41 U2.8 ; 42.44,89.41 U2.8 ; 42.44,89.41 21.93,89.41 ; C3.1 69.74,99.19 U3.8 ; U6.8 39.84,20.45 ; U6.8 37.36,10.23 C6.1 ; U6.8 34.87,20.45 ; 39.84,20.45 34.87,20.45 ; 39.84,20.45 59.96,20.45 ; U2.8 44.65,99.26 C2.1 ; U4.8 88.65,19.07 88.65,21.59 87.12,23.11 15.75,23.11 10.41,28.45 9.14,28.45 7.49,26.8 U7.1 13.8,20.45 34.87,20.45 ; U4.8 87.54,10.09 C4.1
  Bottom Layer w0.254: U9.1 3.81,84.41 3.81,30.44 U7.1 ; C1.1 14.31,100.55 9.6,105.26 H13.2 H13.3
$1N6110: length 13.5
  Top Layer w0.762: H2.1 49.73,98.38 U2.6
$1N6116: length 13.5
  Top Layer w0.762: U2.5 52.27,98.38 H2.2
$1N6130: length 13.5
  Top Layer w0.762: H2.3 54.81,98.38 U2.4
$1N6134: length 13.5
  Top Layer w0.762: H2.4 57.35,98.38 U2.3
$1N6138: length 13.3
  Top Layer w0.762: H1.4 32.28,98.44 U1.3
$1N6142: length 13.3
  Top Layer w0.762: U1.4 29.74,98.44 H1.3
$1N6144: length 13.3
  Top Layer w0.762: H1.2 27.2,98.44 U1.5
$1N6148: length 13.3
  Top Layer w0.762: H1.1 24.66,98.44 24.66,91.76
$1N6152: length 13.4
  Top Layer w0.762: H3.4 82.44,98.45 U3.3
$1N6156: length 13.4
  Top Layer w0.762: H3.3 79.9,98.45 U3.4
$1N6158: length 13.4
  Top Layer w0.762: H3.2 77.36,98.45 U3.5
$1N6162: length 13.4
  Top Layer w0.762: H3.1 74.82,98.45 U3.6
$1N6166: length 13.6
  Top Layer w0.762: H4.4 74.84,11.21 U4.3
$1N6170: length 13.6
  Top Layer w0.762: H4.3 77.38,11.21 U4.4
$1N6172: length 13.6
  Top Layer w0.762: 75.06,6.35 79.92,11.21 U4.5
$1N6176: length 13.6
  Top Layer w0.762: H4.1 82.46,11.21 U4.6
$1N6180: length 13.6
  Top Layer w0.762: U5.3 49.75,11.14 H5.4
$1N6184: length 13.6
  Top Layer w0.762: U5.4 52.29,11.14 H5.3
$1N6186: length 13.6
  Top Layer w0.762: H5.2 54.83,11.14 U5.5
$1N6190: length 13.6
  Top Layer w0.762: H5.1 57.37,11.14 U5.6
$1N6194: length 13.6
  Top Layer w0.762: H6.4 24.66,11.07 U6.3
$1N6198: length 13.6
  Top Layer w0.762: U6.4 27.2,11.07 H6.3
$1N6200: length 13.6
  Top Layer w0.762: U6.5 29.74,11.07 H6.2
$1N6204: length 13.6
  Top Layer w0.762: U6.6 32.28,11.07 H6.1
$1N6621: length 37.8
  Top Layer w0.254: U1.10 34.82,78.99 49.54,64.26 63.37,64.26 U8.9
$1N6634: length 13.4
  Top Layer w0.254: U8.12 59.89,68.4 U2.10
$1N6640: length 15.5
  Top Layer w0.254: U8.13 v1(58.42,69.47)
  Bottom Layer w0.254: U2.9 62.43,73.48 v1(58.42,69.47)
$1N6650: length 17.5
  Bottom Layer w0.254: U3.10 84.98,78.25 U8.6
$1N6666: length 22.1
  Top Layer w0.254: U3.9 76.99,68.45 72.64,68.45 U8.7
$1N6678: length 22.4
  Bottom Layer w0.254: U8.20 61.73,42.28 69.5,42.28 71.79,40 71.79,31.11 U4.10
$1N6689: length 15.8
  Top Layer w0.254: U8.21 62.99,37.36 U4.9
$1N6700: length 33.7
  Bottom Layer w0.254: 47.2,30.6 54.06,37.46 54.06,44.06 54.82,44.82 69.35,44.82 U8.24
$1N6708: length 40
  Bottom Layer w0.254: 44.66,30.6 51.65,37.58 51.65,44.16 53.84,46.35 70.37,46.35 U8.25
$1N8390: length 54.7
  Top Layer w0.254: U8.30 84.2,41.91 75.69,41.91 v1(74.42,43.18)
  Bottom Layer w0.254: v1(74.42,43.18) 74.42,43.94 69.85,48.51 H7.3
$1N8397: length 58.1
  Top Layer w0.254: U8.29 82.17,42.42 77.6,42.42 76.84,43.18 v1(76.84,44.2)
  Bottom Layer w0.254: v1(76.84,44.2) 71.25,49.78 31.12,49.78 H8.3
$1N8979: length 181.2
  Top Layer w0.254: v1(66.63,81.4) 49.61,81.4 U2.15 45.92,77.72 v1(38.12,77.72)
  Bottom Layer w0.254: U3.15 71.01,80.26 67.77,80.26 v1(66.63,81.4) ; U4.15 83.72,29.33 61.17,29.33 59.91,30.6 58.63,29.33 36.09,29.33 U6.15 33.59,29.37 32.7,29.37 32.66,29.33 18.18,29.33 17.42,30.09 17.42,51.54 17.51,51.54 H10.2 22.12,71.61 U1.15 23.52,77.72 v1(38.12,77.72)
$1N9329: length 175.4
  Top Layer w0.254: 57.37,30.6 57.37,28.79 v1(56.77,28.19) ; 57.37,30.6 59.28,32.51 64.52,32.51 68.71,28.32 80.18,28.32 U4.14 ; 57.37,30.6 57.37,37.25 51.56,43.05 51.56,44.07 36.83,58.8 36.83,62.1 H9.2 32.77,66.17 32.77,71.01 24.66,79.12 26.57,81.03 34.69,81.03 36.09,79.62 36.09,78.61 37.61,77.08 47.83,77.08 U2.14 51.51,80.76 62.43,80.76 62.94,80.26 73.55,80.26 U3.14 ; U6.14 36.08,26.8 45.85,26.8 47.24,28.19 v1(50.55,28.19)
  Bottom Layer w0.254: v1(50.55,28.19) v1(56.77,28.19)
$1N9443: length 30.9
  Bottom Layer w0.254: U1.9 41.93,79.12 53.36,67.69 61.73,67.69 U8.10
$1N9499: length 78.6
  Top Layer w0.254: U8.5 75.71,66.4 v1(75.71,61.71)
  Bottom Layer w0.254: U6.10 22.37,30.85 22.37,39.24 27.99,44.86 27.99,49.08 38.85,59.94 73.93,59.94 v1(75.71,61.71)
$1N9508: length 80.1
  Bottom Layer w0.254: U8.4 74.55,62.74 40.39,62.74 19.58,41.93 U6.9
$1N13058: length 32.1
  Top Layer w0.254: U8.26 70.61,48.64 v1(70.61,63.62)
  Bottom Layer w0.254: H12.1 66.8,69.34 66.8,65.91 67.56,65.15 69.08,65.15 v1(70.61,63.62)
$1N13065: length 28.1
  Top Layer w0.254: U8.23 69.34,44.83 69.34,66.93 70.61,68.2 H12.2
$1N13086: length 33.6
  Top Layer w0.254: H12.3 72.01,71.75 70.1,71.75 69.34,70.99 69.34,69.47 66.8,66.93 66.8,44.83 U8.22
$1N13111: length 14.4
  Bottom Layer w0.254: U8.19 60.96,40.51 69.47,40.51 H11.2
$1N13121: length 14.4
  Bottom Layer w0.254: U8.18 59.56,39.37 H11.1
$1N14592: length 2.7
  Top Layer w0.254: LED1.1 R4.2
$1N15391: length 2.8
  Top Layer w0.254: LED2.1 49.92,82.79 R5.2
$1N15491: length 2.8
  Top Layer w0.254: LED3.1 75.06,82.82 R6.2
$1N15591: length 2.7
  Top Layer w0.254: LED4.1 75.13,26.71 R7.2
$1N17393: length 2.7
  Top Layer w0.254: LED5.1 R8.2
$1N17491: length 2.7
  Top Layer w0.254: R9.2 24.9,26.78 LED6.1
$1N19393: length 2
  Top Layer w0.254: LED7.2 18.55,59.53 R10.2
$1N19496: length 174.1
  Top Layer w0.254: 23.38,82.92 24.52,81.79 38.86,81.79 39.88,82.8 R5.1 49.92,84.33 65.15,84.33 66.67,82.8 R6.1 ; 23.38,82.92 23.38,66.04 29.48,59.94 30.24,59.94 34.81,55.37 Q3.3 34.81,52.05 36.58,50.29 36.58,42.66 25.92,32 25.92,29.34 R9.1 25.85,24.32 45.92,24.32 R8.1 50.87,24.32 71.07,24.32 R7.1 ; 23.38,82.92 R4.1
$1N19657: length 196.3
  Top Layer w0.254: v1(54.14,31.87) 38.65,31.87 37.58,30.8 U6.16 37.36,53.37 Q3.1 ; U8.8 68.07,45.15 66.66,43.74 66.66,37.1 69.09,34.67 85.98,34.67 87.53,33.11 U4.16 86.26,31.87 v1(71.08,31.87)
  Bottom Layer w0.254: v1(71.08,31.87) 63.72,31.87 62.44,30.6 61.17,31.87 v1(54.14,31.87) ; U1.16 20.85,80.39 43.25,80.39 U2.16 45.92,80.26 65.48,80.26 66.75,78.99 U3.16 69.74,78.17 69.29,77.72 69.29,67.64 U8.8
$1N20868: length 6.8
  Bottom Layer w0.254: H11.3 77.34,43.56 U8.27
$1N21347: length 6.8
  Bottom Layer w0.254: U8.28 79.88,43.56 H11.4
$1N21361: length 18.3
  Top Layer w0.254: H12.4 74.04,72.26 66.29,72.26 U8.11

## Copper pours and planes (outline as drawn; the poured copper is in the pictures)
+5V on Top Layer: 1.4,42.04 28.7,42.04 28.7,11.79 1.4,11.79
GND on Top Layer: -12.06,120.14 103.12,120.14 103.12,-8.51 -12.06,-8.51
GND on Bottom Layer: -5.33,116.59 100.71,116.59 100.71,-6.99 -5.33,-6.99
VCC on Top Layer: 7.49,28.45 88.65,28.45 88.65,17.96 7.49,17.96
VCC on Top Layer: 7.37,91.76 70.99,91.76 70.99,86.61 7.37,86.61

## Text on the board
Top Silkscreen Layer: fan1 | fan3 | fan4 | fan2 | VCC | +5V | 3V3 | GND | servo1 | MS1 | servo2 | MS2 | D21 | D15 | D5 | D2 | D17 | D3 | D14 | D1 | ESP32 | Dumb-E control board V1
